# Altium schematic sheet TELEMETRY.SchDoc
size A4; DocumentNumber: 13; SheetNumber: 15; SheetTotal: 19
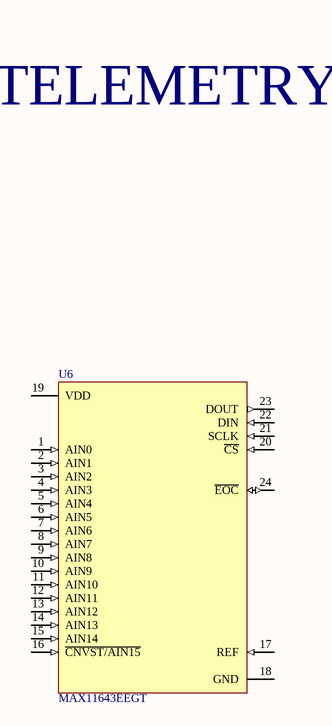
[diagram p0: TELEMETRY.SchDoc]

## Parts
U6  MAX11643EEGT  [MAX11643EEG+]

## Nets

Not connected (* = marked no-connect by the designer): U6 1(AIN0) 2(AIN1) 3(AIN2) 4(AIN3) 5(AIN4) 6(AIN5) 7(AIN6) 8(AIN7) 9(AIN8) 10(AIN9) 11(AIN10) 12(AIN11) 13(AIN12) 14(AIN13) 15(AIN14) 16(~{CNVST/AIN15}) 17(REF) 18(GND) 19(VDD) 20(~{CS}) 21(SCLK) 22(DIN) 23(DOUT) 24(~{EOC})

## Notes on the sheet
- TELEMETRY

## Library data of the parts
U6 = IC_MAX11643EEGT: 8 Bit Analog to Digital Converter 16 Input 1 SAR 24-QSOP; Mfr: Maxim Integrated; Number of Bits: 8; Sampling rate: 300k; Number of inputs: 16; Input Type: Single Ended; Internal Reference: 2.5V; Internal Clock: 4.4MHz; Voltage Supply: 2.7V - 3.6V; Operating Temperature: -40C to 85C; Supplier 1: Mouser; Supplier Part Number 1: 700-MAX11643EEG+; ComponentLink1Description: Digikey; ComponentLink1URL: https://www.digikey.ca/en/products/detail/analog-devices-inc-maxim-integrated/MAX11643EEG/2793247; ComponentLink2Description: Datasheet; ComponentLink2URL: https://datasheets.maximintegrated.com/en/ds/MAX11638-MAX11643.pdf